# Altium schematic sheet motor&sensor.SchDoc
size A4
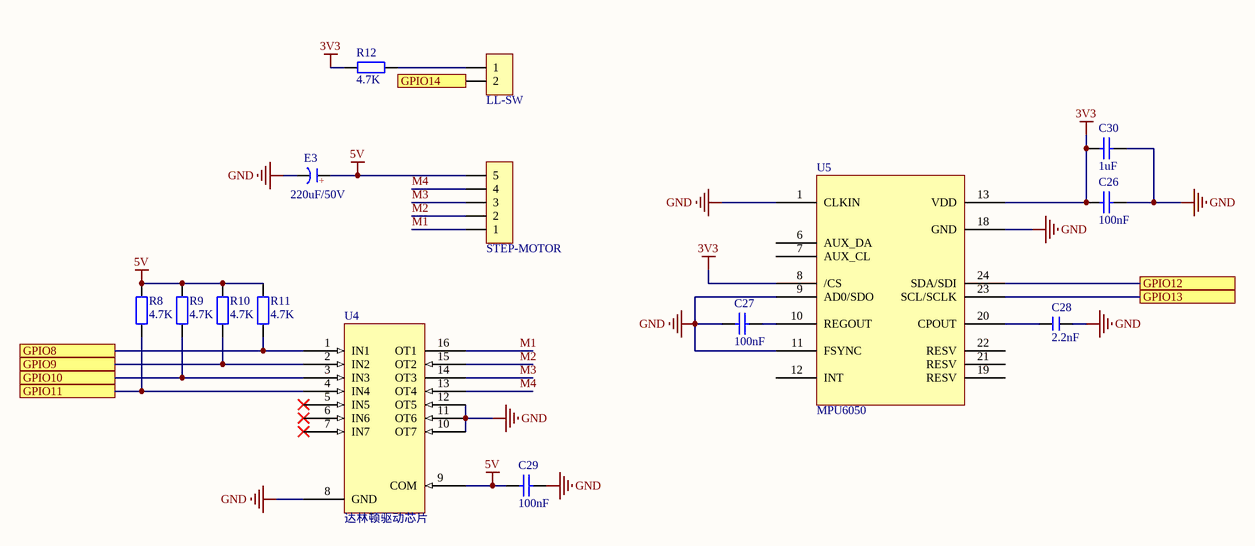
[diagram p0: motor&sensor.SchDoc]

## Parts
C26  100nF  [C 0603_L]
C27  100nF  [C 0603_L]
C28  2.2nF  [C 0603_L]
C29  100nF  [C 0603_L]
C30  1uF  [C 0603_L]
E3  220uF/50V  [CT 10*8 - C]
LL-SW  HDR-1X2  [XH2.54-WI-2P]  (value not drawn)
R8  4.7K  [R 0603_L]
R9  4.7K  [R 0603_L]
R10  4.7K  [R 0603_L]
R11  4.7K  [R 0603_L]
R12  4.7K  [R 0603_L]
STEP-MOTOR  HDR-1X5  [XH2.54-WI-5P]  (value not drawn)
U4  达林顿驱动芯片  [SOP16]
U5  MPU6050  [QFN24 4x4_N]

## Ports
GPIO8, GPIO9, GPIO10, GPIO11, GPIO12, GPIO13, GPIO14

## Nets
3V3: C26.1 C30.1 R12.2 U5.8(/CS) U5.13(VDD)
5V: C29.1 E3.1(A) R8.2 R9.2 R10.2 R11.2 STEP-MOTOR.5 U4.9(COM)
GND: C26.2 C27.1 C28.1 C29.2 C30.2 E3.2(K) U4.8(GND) U4.10(OT7) U4.11(OT6) U4.12(OT5) U5.1(CLKIN) U5.9(AD0/SDO) U5.11(FSYNC) U5.18(GND)
GPIO8: R11.1 U4.1(IN1) ; port GPIO8
GPIO9: R10.1 U4.2(IN2) ; port GPIO9
GPIO10: R9.1 U4.3(IN3) ; port GPIO10
GPIO11: R8.1 U4.4(IN4) ; port GPIO11
GPIO12: U5.24(SDA/SDI) ; port GPIO12
GPIO13: U5.23(SCL/SCLK) ; port GPIO13
GPIO14: LL-SW.2 ; port GPIO14
M1: STEP-MOTOR.1 U4.16(OT1)
M2: STEP-MOTOR.2 U4.15(OT2)
M3: STEP-MOTOR.3 U4.14(OT3)
M4: STEP-MOTOR.4 U4.13(OT4)
NetC27_2: C27.2 U5.10(REGOUT)
NetC28_2: C28.2 U5.20(CPOUT)
NetLL-SW_1: LL-SW.1 R12.1

Not connected (* = marked no-connect by the designer): U4 5(IN5)* 6(IN6)* 7(IN7)*; U5 6(AUX_DA) 7(AUX_CL) 12(INT) 19(RESV) 21(RESV) 22(RESV)

## Notes on the sheet
- (in symbol CS_SMD) +

## Library data of the parts
C26-C30 = C: 贴片电容; BOM名称: 无极性贴片电容; 优秀评价可免费更新: 联系淘宝ID：黄晶宝石，获取更新版封装库; 本封装库来自淘宝卖家 ID：黄晶宝石: 其他店铺购入均为盗版，请立即申请退款; 联系卖家，免费查找封装: 唯一出售店铺网址https://shop463601444.taobao.com
E3 = CS_SMD: 贴片固态电容; 优秀评价可免费更新: 联系淘宝ID：黄晶宝石，获取更新版封装库; 本封装库来自淘宝卖家 ID：黄晶宝石: 其他店铺购入均为盗版，请立即申请退款; 联系卖家，免费查找封装: 唯一出售店铺网址https://shop463601444.taobao.com; BOM名称: 贴片固态电容
LL-SW = Header 2: 2P接插件; 封装库来自淘宝卖家  ID：黄晶宝石: 其他店铺购入均为盗版假冒封装库，请立即申请退款; 技术支持， 联系售后: 唯一出售店铺网址https://shop463601444.taobao.com; BOM名称: 2P接插件
R8-R12 = R: 贴片电阻; 优秀评价可免费更新: 联系淘宝ID：黄晶宝石，获取更新版封装库; 本封装库来自淘宝卖家 ID：黄晶宝石: 其他店铺购入均为盗版，请立即申请退款; 联系卖家，免费查找封装: 唯一出售店铺网址https://shop463601444.taobao.com; BOM名称: 贴片电阻
STEP-MOTOR = Header 5: 5P接插件; 封装库来自淘宝卖家  ID：黄晶宝石: 其他店铺购入均为盗版假冒封装库，请立即申请退款; 技术支持， 联系售后: 唯一出售店铺网址https://shop463601444.taobao.com; BOM名称: 5P接插件
U4 = ULN2003: 优秀评价可免费更新: 联系淘宝ID：黄晶宝石，获取更新版封装库; 卖家免费技术支持，联系售后: 唯一出售店铺网址https://shop463601444.taobao.com; 封装库来自淘宝卖家ID：黄晶宝石: 其他店铺购入均为假冒，请立即申请退款，本店奖励2~5元现金
U5 = MPU6050: 三轴加速度计和三轴陀螺仪，工作电压：2.375V~3.46V